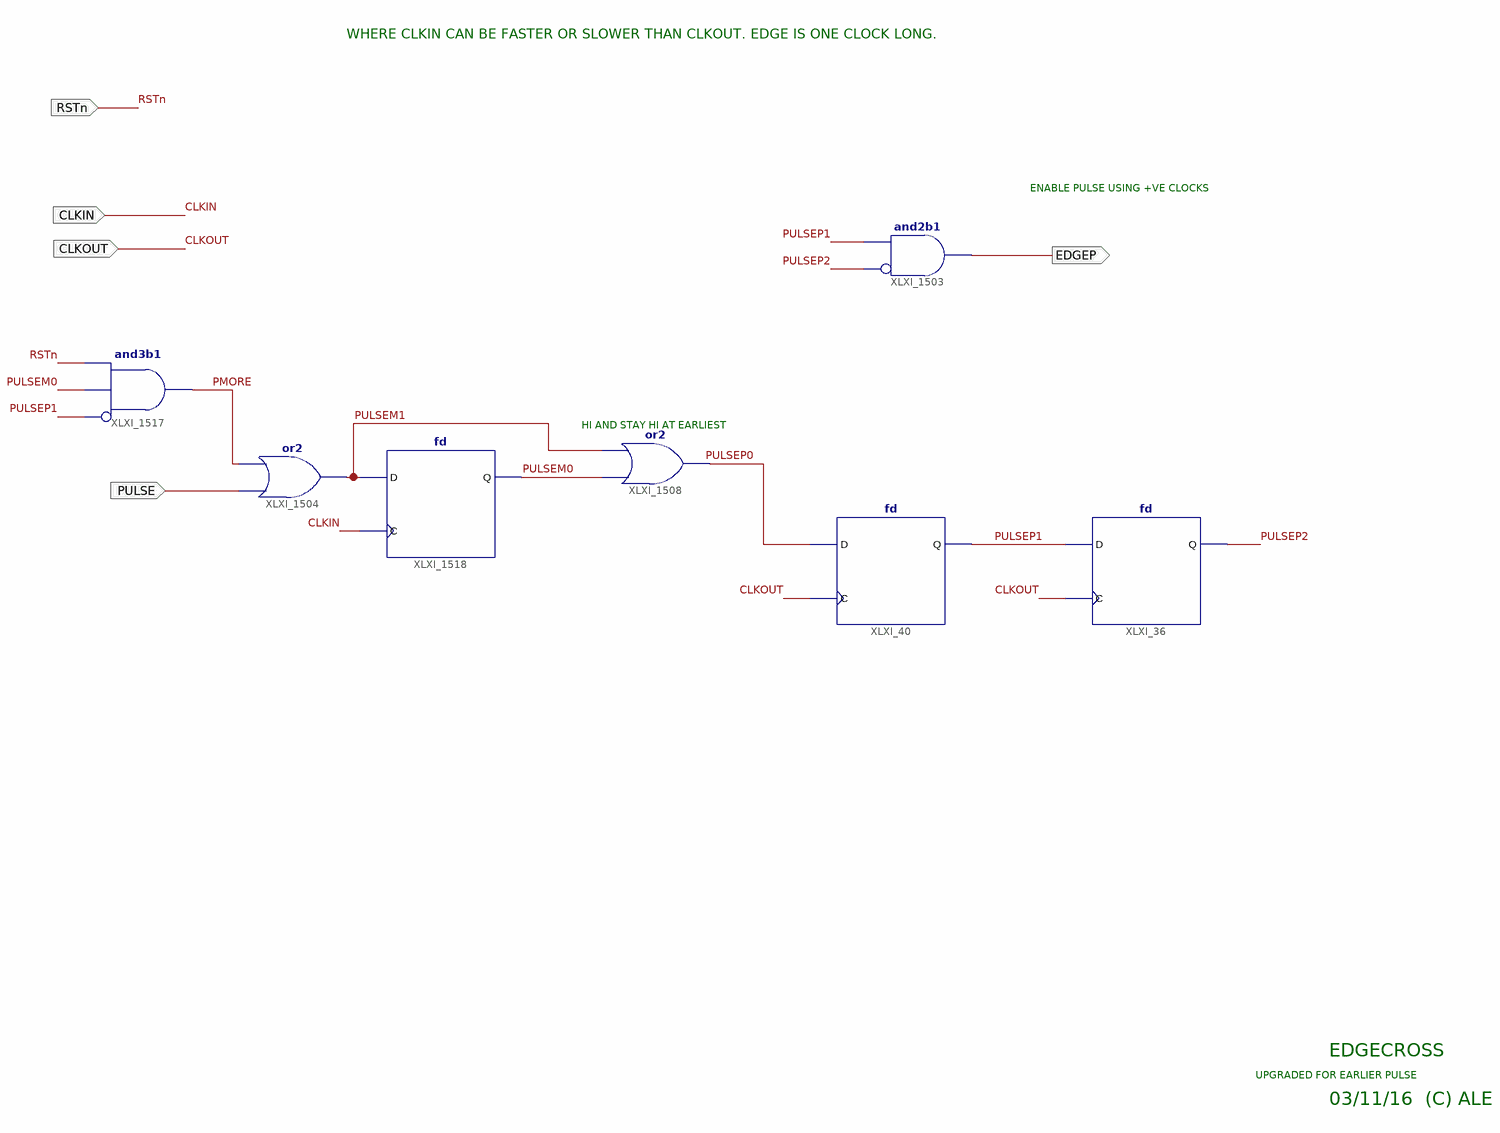
[diagram p0: schematic sheet 1]
// Xilinx ISE schematic EdgeCross.sch (zynq) as structural Verilog: 7 symbols, 5 ports
module EdgeCross (
  input  CLKIN,
  input  CLKOUT,
  input  PULSE,
  input  RSTn,
  output EDGEP
);

  wire PMORE, PULSEM0, PULSEM1, PULSEP0, PULSEP1, PULSEP2;

  or XLXI_1504 (PULSEM1, PULSE, PMORE);
  and XLXI_1503 (EDGEP, ~PULSEP2, PULSEP1);  // and2b1
  or XLXI_1508 (PULSEP0, PULSEM0, PULSEM1);
  fd XLXI_36 (.C(CLKOUT), .D(PULSEP1), .Q(PULSEP2));
  fd XLXI_40 (.C(CLKOUT), .D(PULSEP0), .Q(PULSEP1));
  and XLXI_1517 (PMORE, ~PULSEP1, PULSEM0, RSTn);  // and3b1
  fd XLXI_1518 (.C(CLKIN), .D(PULSEM1), .Q(PULSEM0));

  // Notes on the sheet:
  //   WHERE CLKIN CAN BE FASTER OR SLOWER THAN CLKOUT. EDGE IS ONE CLOCK LONG.
  //   ENABLE PULSE USING +VE CLOCKS
  //   HI AND STAY HI AT EARLIEST
  //   EDGECROSS
  //   UPGRADED FOR EARLIER PULSE
  //   03/11/16  (C) ALE
endmodule
